# EAGLE schematic IMU (EAGLE 7.2.0)
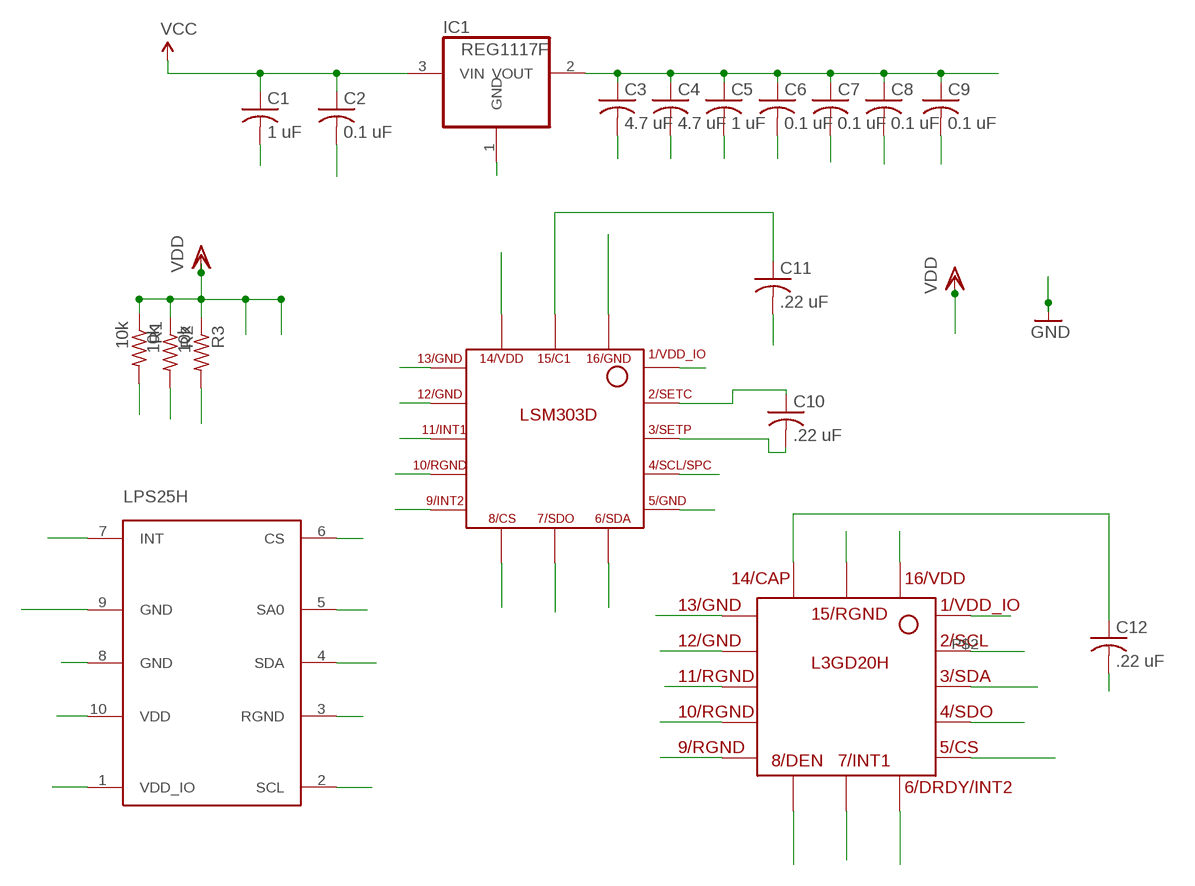
[diagram p0: schematic, sheet 1]

## Parts
C1  1 uF  C-USC0805  [C0805]
C2  0.1 uF  C-USC0805  [C0805]
C3  4.7 uF  C-USC0805  [C0805]
C4  4.7 uF  C-USC0805  [C0805]
C5  1 uF  C-USC0805  [C0805]
C6  0.1 uF  C-USC0805  [C0805]
C7  0.1 uF  C-USC0805  [C0805]
C8  0.1 uF  C-USC0805  [C0805]
C9  0.1 uF  C-USC0805  [C0805]
C10  .22 uF  C-USC0805  [C0805]
C11  .22 uF  C-USC0805  [C0805]
C12  .22 uF  C-USC0805  [C0805]
IC1  REG1117F  [DD-3]
LPS25H  LPS25H  [LPS25H]
R1  10k  R-US_R0805  [R0805]
R2  10k  R-US_R0805  [R0805]
R3  10k  R-US_R0805  [R0805]
U$1  LSM303D  [LGA-16]
U$2  L3GD20H  [LGA-16]

## Nets
GND: C1.2 C2.2 C3.2 C4.2 C5.2 C6.2 C7.2 C8.2 C9.2 C11.2 C12.2 IC1.1(GND) LPS25H.8(GND) LPS25H.9(GND) U$1.P$10(10/RGND) U$1.P$12(12/GND) U$1.P$13(13/GND) U$1.P$16(16/GND) U$2.P$9(9/RGND) U$2.P$10(10/RGND) U$2.P$11(11/RGND) U$2.P$12(12/GND) U$2.P$13(13/GND) U$2.P$15(15/RGND)
N$3: C10.1 U$1.P$2(2/SETC)
N$4: C11.1 U$1.P$15(15/C1)
N$5: C10.2 U$1.P$3(3/SETP)
N$8: U$1.P$5(5/GND)
N$12: U$1.P$9(9/INT2)
N$14: U$1.P$11(11/INT1)
N$20: LPS25H.3(RGND)
N$22: LPS25H.7(INT)
N$29: C12.1 U$2.P$14(14/CAP)
N$35: U$2.P$6(6/DRDY/INT2)
N$36: U$2.P$7(7/INT1)
N$37: U$2.P$8(8/DEN)
SCL: LPS25H.2(SCL) R2.2 U$1.P$4(4/SCL/SPC) U$2.P$2(2/SCL)
SDA: LPS25H.4(SDA) R1.2 U$1.P$6(6/SDA/SDI/SDO) U$2.P$3(3/SDA)
SDO: LPS25H.5(SA0) R3.2 U$1.P$7(7/SDO/SA0) U$2.P$4(4/SDO)
VCC: C1.1 C2.1 IC1.3(VIN)
VDD: C3.1 C4.1 C5.1 C6.1 C7.1 C8.1 C9.1 IC1.2(VOUT) LPS25H.1(VDD_IO) LPS25H.6(CS) LPS25H.10(VDD) R1.1 R2.1 R3.1 U$1.P$1(1/VDD_IO) U$1.P$8(8/CS) U$1.P$14(14/VDD) U$2.P$1(1/VDD_IO) U$2.P$5(5/CS) U$2.P$16(16/VDD)

## Library data of the parts
C1-C12 = adafruit:C-US: CAPACITOR, American symbol
IC1 = burr-brown:REG1117: 800mA and 1A Low Dropout (LDO) Positive Regulator 1.8V, 2.5V, 2.85V, 3.3V, 5V, and Adj; MF: TEXAS INSTRUMENTS; MPN: REG1117FAKTTT; OC_FARNELL: 1296120; OC_NEWARK: 87H2562
LPS25H = chips:LPS25H: ST-Micro Piezoresistive pressure sensor; DIGIKEY: 497-15070-1-ND
R1-R3 = adafruit:R-US_: RESISTOR, American symbol
U$1 = IMU_chips:LSM303D
U$2 = IMU_chips:L3GD20H